# Altium schematic sheet Sim_Sheet.SchDoc
size A4
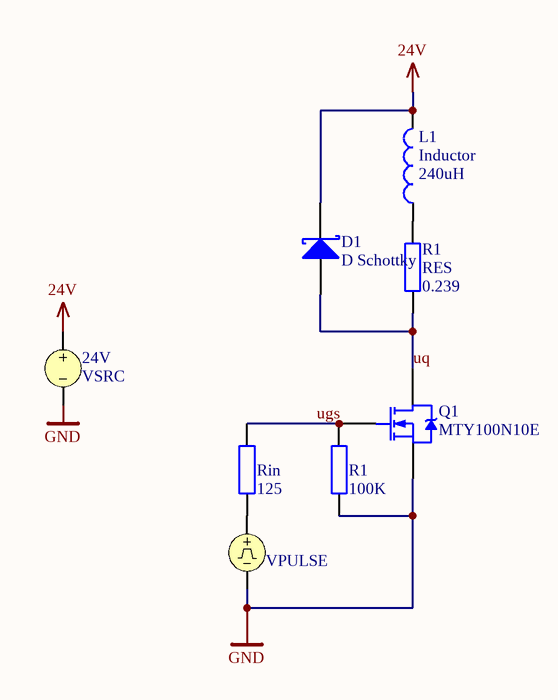
[diagram p0: Sim_Sheet.SchDoc]

## Parts
24V  VSRC
D1  D Schottky  [SMB]
L1  Inductor  value 240uH  [0402-A]
Q1  MTY100N10E  [TO-220V]
R1  RES  value 0.239  [Axial-0.4]
R2  R1  value 100K  [Axial-0.4]
RIN1  Rin  value 125  [Axial-0.4]
µC  VPULSE

## Nets
24V: 24V.1 D1.2(K) L1.2
GND: Q1.3(S) R2.2 µC.2
ugs: Q1.1(G) R2.1 RIN1.2
uq: D1.1(A) Q1.2(D) R1.1
NetL1_1: L1.1 R1.2
NetRIN1_1: RIN1.1 µC.1

Not connected (* = marked no-connect by the designer): 24V 2

## Notes on the sheet
- Labels drawn without touching a wire or pin: GND

## Library data of the parts
24V = VSRC: Voltage Source; Note: PCB Footprint - Not required; Value: +24; Published: 8-Jun-2000; LatestRevisionDate: 17-Jul-2002; LatestRevisionNote: Re-released for DXP Platform.; PackageReference: Not Applicable; Publisher: Altium Limited
D1 = D Schottky: Schottky Diode; Published: 8-Jun-2000; LatestRevisionDate: 17-Jul-2002; LatestRevisionNote: Re-released for DXP Platform.; PackageReference: SMB; Publisher: Altium Limited; PackageDescription: DO-214-AA/SMB; 2 C-Bend Leads; Body 5.3 x 3.6 mm, inc. leads (LxW); Code_JEDEC: DO-214-AA
L1 = Inductor: Code_IEC: 1005; Published: 8-Jun-2000; LatestRevisionDate: 29-May-2009; LatestRevisionNote: IPC-7351 Footprint Added.; PackageReference: 0402-A; Publisher: Altium Limited; PackageDescription: Chip Inductor; Code_JEITA: 0402
Q1 = MTY100N10E: TMOS E-FET Power Field Effect Transistor; ComponentAvailability: Obsolete; Published: 29-Sep-2000; LatestRevisionDate: 17-Jul-2002; LatestRevisionNote: Re-released for DXP Platform.; DatasheetVersion: 1995; PackageVersion: 1996; PackageReference: 340G-02; Publisher: Altium Limited; PackageDescription: SIP with Mounting Hole; 3 Leads; Body 26 x 19.8 x 5 mm (typ); Pitch 5.45 mm; ComponentLink1Description: Manufacturer Link; ComponentLink1URL: http://www.onsemi.com/site/products/landing?taxonomyID=194; ComponentLink2Description: Datasheet; ComponentLink2URL: http://www.onsemi.com/pub/Collateral/MTY100N10E-D.PDF
R1 R2 RIN1 = RES: Widerstand
µC = VPULSE: Pulse Voltage Source; Note: PCB Footprint - Not required; Published: 8-Jun-2000; LatestRevisionDate: 15-Nov-2004; LatestRevisionNote: Corrected Netlist.; PackageReference: Not Applicable; Publisher: Altium Limited